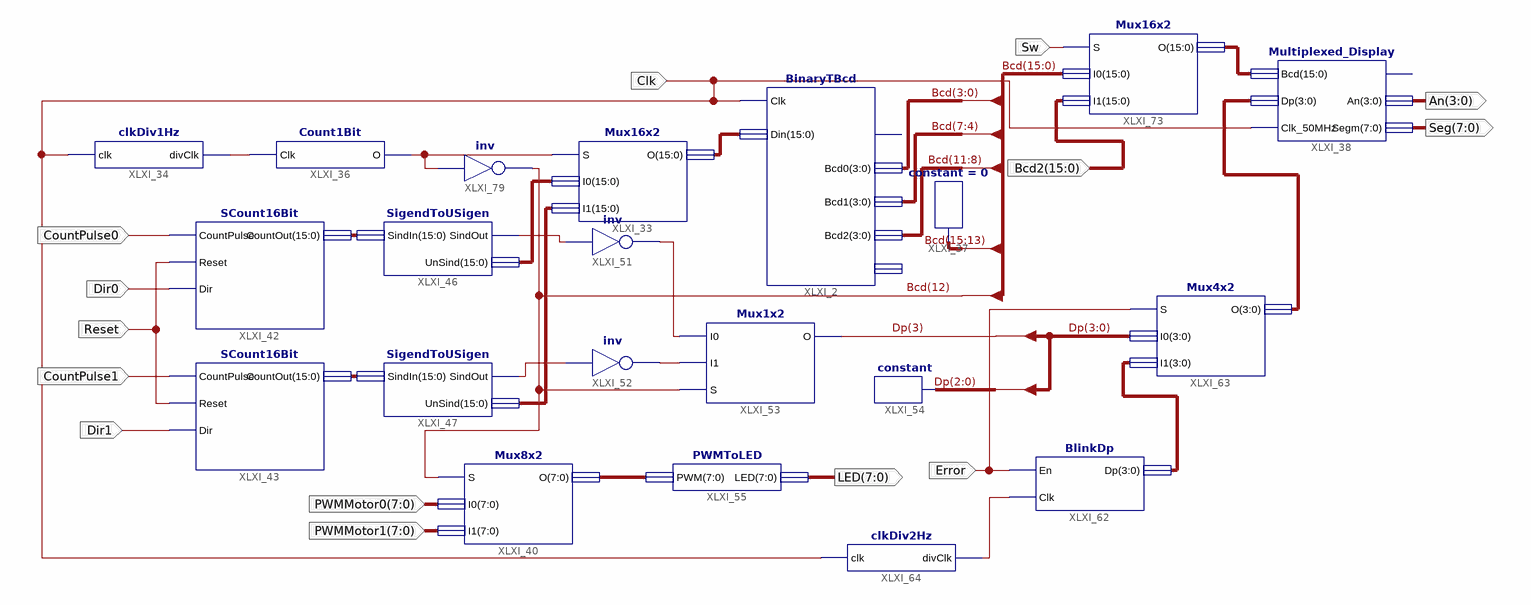
[diagram p0: schematic sheet 1]
// Xilinx ISE schematic InfoDis.sch (spartan3e) as structural Verilog: 21 symbols, 14 ports
module InfoDis (
  input  CountPulse0,
  input  Dir1,
  input  Dir0,
  input  CountPulse1,
  input  Reset,
  input  Clk,
  input  Error,
  input  [7:0] PWMMotor0,
  input  [7:0] PWMMotor1,
  input  Sw,
  input  [15:0] Bcd2,
  output [7:0] LED,
  output [7:0] Seg,
  output [3:0] An
);

  wire XLXN_146, XLXN_293, XLXN_294, XLXN_295, XLXN_296, XLXN_321, XLXN_362;
  wire [3:0] Dp, XLXN_317, XLXN_318;
  wire [7:0] XLXN_301;
  wire [15:0] Bcd, XLXN_143, XLXN_283, XLXN_284, XLXN_285, XLXN_300, XLXN_356;

  constant #(.CValue("0")) XLXI_37 (.O(Bcd[15:13]));
  BinaryTBcd XLXI_2 (
    .Clk(Clk), .Din(XLXN_143), .Bcd0(Bcd[3:0]), .Bcd1(Bcd[7:4]), .Bcd2(Bcd[11:8]));  // open: ModOut, Bcd3
  Mux16x2 XLXI_33 (.S(XLXN_362), .I0(XLXN_285), .I1(XLXN_300), .O(XLXN_143));
  clkDiv1Hz XLXI_34 (.clk(Clk), .divClk(XLXN_146));
  SCount16Bit XLXI_43 (.CountPulse(CountPulse1), .Reset(Reset), .Dir(Dir1), .CountOut(XLXN_284));
  SCount16Bit XLXI_42 (.CountPulse(CountPulse0), .Reset(Reset), .Dir(Dir0), .CountOut(XLXN_283));
  SigendToUSigen XLXI_46 (.SindIn(XLXN_283), .SindOut(XLXN_293), .UnSind(XLXN_285));
  SigendToUSigen XLXI_47 (.SindIn(XLXN_284), .SindOut(XLXN_294), .UnSind(XLXN_300));
  not XLXI_51 (XLXN_295, XLXN_293);
  not XLXI_52 (XLXN_296, XLXN_294);
  Mux1x2 XLXI_53 (.I0(XLXN_295), .I1(XLXN_296), .S(Bcd[12]), .O(Dp[3]));
  constant XLXI_54 (.O(Dp[2:0]));
  BlinkDp XLXI_62 (.En(Error), .Clk(XLXN_321), .Dp(XLXN_318));
  Mux4x2 XLXI_63 (.S(Error), .I0(Dp), .I1(XLXN_318), .O(XLXN_317));
  clkDiv2Hz XLXI_64 (.clk(Clk), .divClk(XLXN_321));
  PWMToLED XLXI_55 (.PWM(XLXN_301), .LED(LED));
  Mux8x2 XLXI_40 (.S(Bcd[12]), .I0(PWMMotor0), .I1(PWMMotor1), .O(XLXN_301));
  Multiplexed_Display XLXI_38 (.Bcd(XLXN_356), .Dp(XLXN_317), .Clk_50MHz(Clk), .An(An), .Segm(Seg));  // open: Clk_1kHz
  Mux16x2 XLXI_73 (.S(Sw), .I0(Bcd), .I1(Bcd2), .O(XLXN_356));
  Count1Bit XLXI_36 (.Clk(XLXN_146), .O(XLXN_362));
  not XLXI_79 (Bcd[12], XLXN_362);
endmodule
